# Altium schematic sheet DAC&DifferenceAmp_backup.SchDoc
size A; SheetNumber: 1; SheetTotal: 2
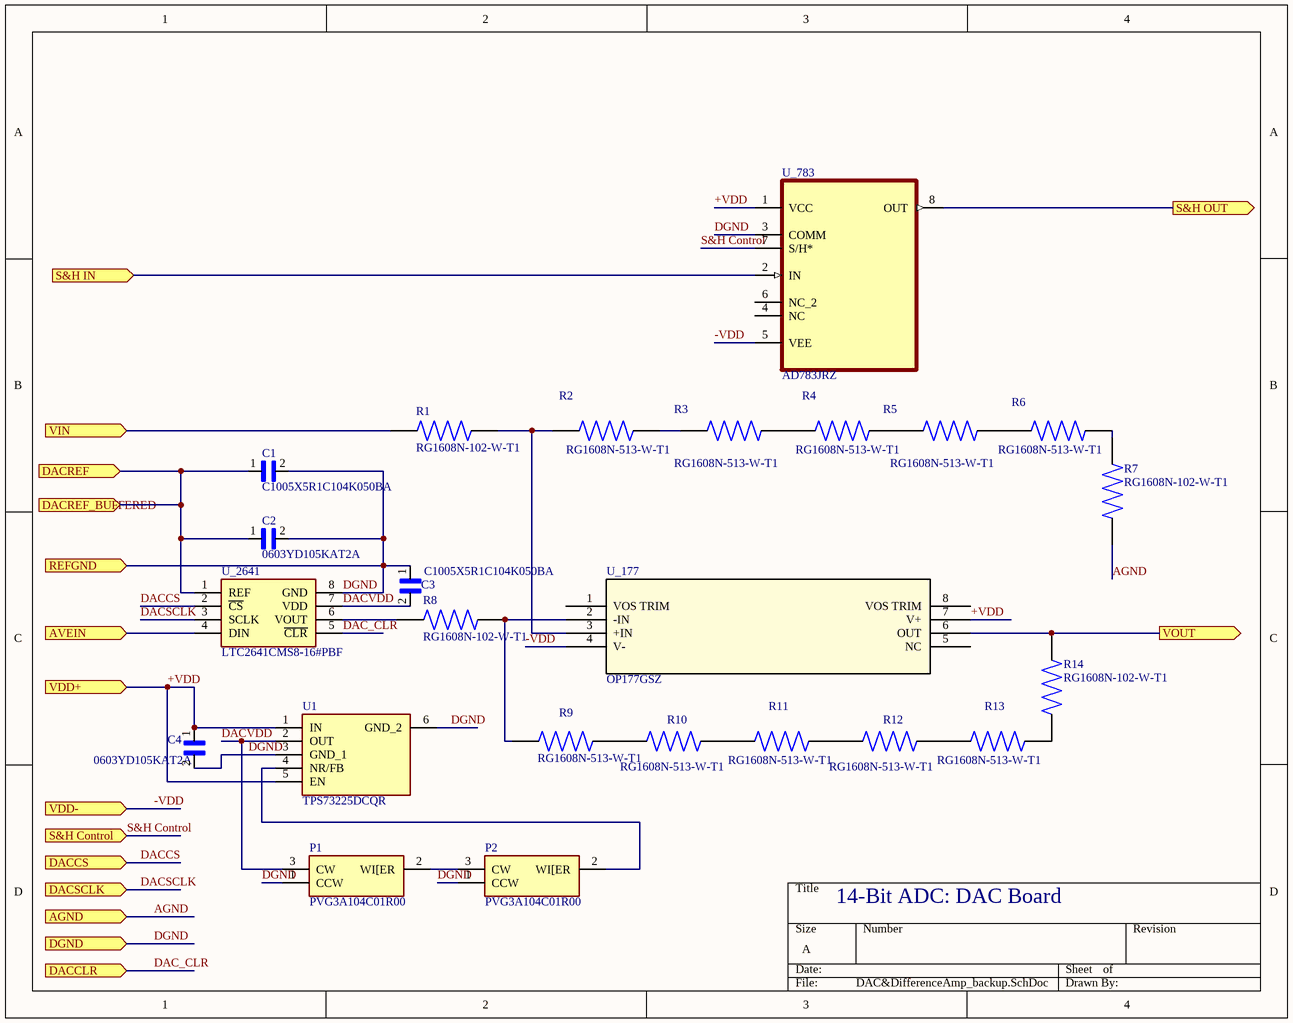
[diagram p0: DAC&DifferenceAmp_backup.SchDoc]

## Parts
C1  C1005X5R1C104K050BA  [CAPC1005X55N]
C2  0603YD105KAT2A  [CAPC1608X90N]
C3  C1005X5R1C104K050BA  [CAPC1005X55N]
C4  0603YD105KAT2A  [CAPC1608X90N]
P1  PVG3A104C01R00  [PVG3A104C01R00]
P2  PVG3A104C01R00  [PVG3A104C01R00]
R1  RG1608N-102-W-T1  [RESC1608X50N]
R2  RG1608N-513-W-T1  [RESC1608X50N]
R3  RG1608N-513-W-T1  [RESC1608X50N]
R4  RG1608N-513-W-T1  [RESC1608X50N]
R5  RG1608N-513-W-T1  [RESC1608X50N]
R6  RG1608N-513-W-T1  [RESC1608X50N]
R7  RG1608N-102-W-T1  [RESC1608X50N]
R8  RG1608N-102-W-T1  [RESC1608X50N]
R9  RG1608N-513-W-T1  [RESC1608X50N]
R10  RG1608N-513-W-T1  [RESC1608X50N]
R11  RG1608N-513-W-T1  [RESC1608X50N]
R12  RG1608N-513-W-T1  [RESC1608X50N]
R13  RG1608N-513-W-T1  [RESC1608X50N]
R14  RG1608N-102-W-T1  [RESC1608X50N]
U1  TPS73225DCQR  [SOT127P706X180-6N]
U_177  OP177GSZ  [R_8_ADI]
U_783  AD783JRZ  [SOIC127P600X272-8N]
U_2641  LTC2641CMS8-16#PBF  [SOP65P490X110-8N]

## Ports
AGND (in), AVEIN (in), DACCLR (in), DACCS (in), DACREF (in), DACREF_BUFFERED (in), DACSCLK (in), DGND (in), REFGND (in), S&H Control (in), S&H IN (in), S&H OUT (out), VDD+ (in), VDD- (in), VIN (in), VOUT (out)

## Nets
+VDD: C4.1 U1.1(IN) U1.5(EN) U_177.7(V+) U_783.1(VCC) ; port VDD+
-VDD: U_177.4(V-) U_783.5(VEE) ; port VDD-
AGND: R7.1 ; port AGND
AVEIN: U_2641.4(DIN) ; port AVEIN
DAC_CLR: U_2641.5(~{CLR}) ; port DACCLR
DACCS: U_2641.2(~{CS}) ; port DACCS
DACREF: C1.1 C2.1 U_2641.1(REF) ; port DACREF, port DACREF_BUFFERED
DACSCLK: U_2641.3(SCLK) ; port DACSCLK
DACVDD: C3.2 P1.3(CW) U1.2(OUT) U_2641.7(VDD)
DGND: C1.2 C2.2 C3.1 C4.2 P1.1(CCW) P2.1(CCW) U1.3(GND_1) U1.6(GND_2) U_783.3(COMM) U_2641.8(GND) ; port DGND, port REFGND
S&H Control: U_783.7(S/H*) ; port S&H Control
S&H IN: U_783.2(IN) ; port S&H IN
S&H OUT: U_783.8(OUT) ; port S&H OUT
VIN: R1.1 ; port VIN
VOUT: R14.2 U_177.6(OUT) ; port VOUT
NetP1_2: P1.2(WI[ER) P2.3(CW)
NetP2_2: P2.2(WI[ER) U1.4(NR/FB)
NetR1_2: R1.2 R2.1 U_177.3(+IN)
NetR2_2: R2.2 R3.1
NetR3_2: R3.2 R4.1
NetR4_2: R4.2 R5.1
NetR5_2: R5.2 R6.1
NetR6_2: R6.2 R7.2
NetR8_1: R8.1 U_2641.6(VOUT)
NetR8_2: R8.2 R9.1 U_177.2(-IN)
NetR9_2: R9.2 R10.1
NetR10_2: R10.2 R11.1
NetR11_2: R11.2 R12.1
NetR12_2: R12.2 R13.1
NetR13_2: R13.2 R14.1

Not connected (* = marked no-connect by the designer): U_177 1(VOS_TRIM) 5(NC) 8(VOS_TRIM); U_783 4(NC) 6(NC_2)

## Notes on the sheet
- 14-Bit ADC: DAC Board

## Library data of the parts
C1 C3 = C1005X5R1C104K050BA: CERAMIC CAPACITOR, 0.1UF, 16V, X5R, 10%, 0402; Package: None; Price: None; Value: *; MP: C1005X5R1C104K050BA; Availability: Unavailable
C2 C4 = 0603YD105KAT2A: 1ÂµF Â±10% 16V Ceramic Capacitor X5R 0603 (1608 Metric); MF: AVX; SnapEDA_Link: https://www.snapeda.com/parts/0603YD105KAT2A/AVX%20/%20Kyocera/view-part/270397/?ref=snap; Value: *; Availability: Unavailable; Price: None; MP: 0603YD105KAT2A; Package: 1608 AVX; DigiKey-Purchase-URL: https://snapeda.com/shop?store=DigiKey&id=270397
P1 P2 = PVG3A104C01R00: Variable Resistor; Manufacturer_Name: Bourns; Datasheet Link: https://componentsearchengine.com//PVG3A104C01R00.pdf; Height: 2mm; Mouser2 Part Number: 81-PVG3A104C01R00; Mouser2 Price/Stock: https://www.mouser.com/Search/Refine.aspx?Keyword=81-PVG3A104C01R00; Manufacturer_Part_Number: PVG3A104C01R00
R1 R7 R8 R14 = RG1608N-102-W-T1: RES SMD 1K OHM 0.05% 1/10W 0603; Package: None; Price: None; Value: *; MP: RG1608N-102-W-T1; Availability: Unavailable
U1 = TPS73225DCQR: Integrated Circuit; Manufacturer_Name: Texas Instruments; Datasheet Link: http://www.ti.com/lit/gpn/tps732; Height: 1.8mm; Manufacturer_Part_Number: TPS73225DCQR
U_177 = OP177GSZ: No Description Available; Vendor: Analog Devices Inc; Built_By: EMA_UL_Team; SourceLibrary: Analog_2012-01-01_9; Manufacturer_Part_Number: OP177GSZ; Copyright: Copyright (C) 2021 Accelerated Designs. All rights reserved; RefDes: RefDes; Type: DEV
U_783 = AD783JRZ: Sample and Hold Amplifier 1 Circuit 8-SOIC; MF: Analog Devices; Purchase-URL: https://pricing.snapeda.com/search/part/AD783JRZ/?ref=eda; Check_prices: https://www.snapeda.com/parts/AD783JRZ/Analog%20Devices%20Inc./view-part/353069/?ref=eda; Value: *; SnapEDA_Link: https://www.snapeda.com/parts/AD783JRZ/Analog%20Devices%20Inc./view-part/353069/?ref=snap; Package: SOIC-8 Analog Devices; Availability: Bad; Price: None; MP: AD783JRZ
U_2641 = LTC2641CMS8-16#PBF: Integrated Circuit; Manufacturer_Name: Analog Devices; Datasheet Link: https://www.analog.com/media/en/technical-documentation/data-sheets/26412fd.pdf; Height: 1.1mm; Manufacturer_Part_Number: LTC2641CMS8-16#PBF; Mouser Part Number: 584-C2641CMS8-16PBF; Mouser Price/Stock: https://www.mouser.com/Search/Refine.aspx?Keyword=584-C2641CMS8-16PBF; Arrow Part Number: LTC2641CMS8-16#PBF; Arrow Price/Stock: https://www.arrow.com/en/products/ltc2641cms8-16pbf/analog-devices
R2-R6 R9-R13 = RG1608N-513-W-T1: Package: None; Price: None; Value: *; MP: RG1608N-513-W-T1; Availability: Unavailable